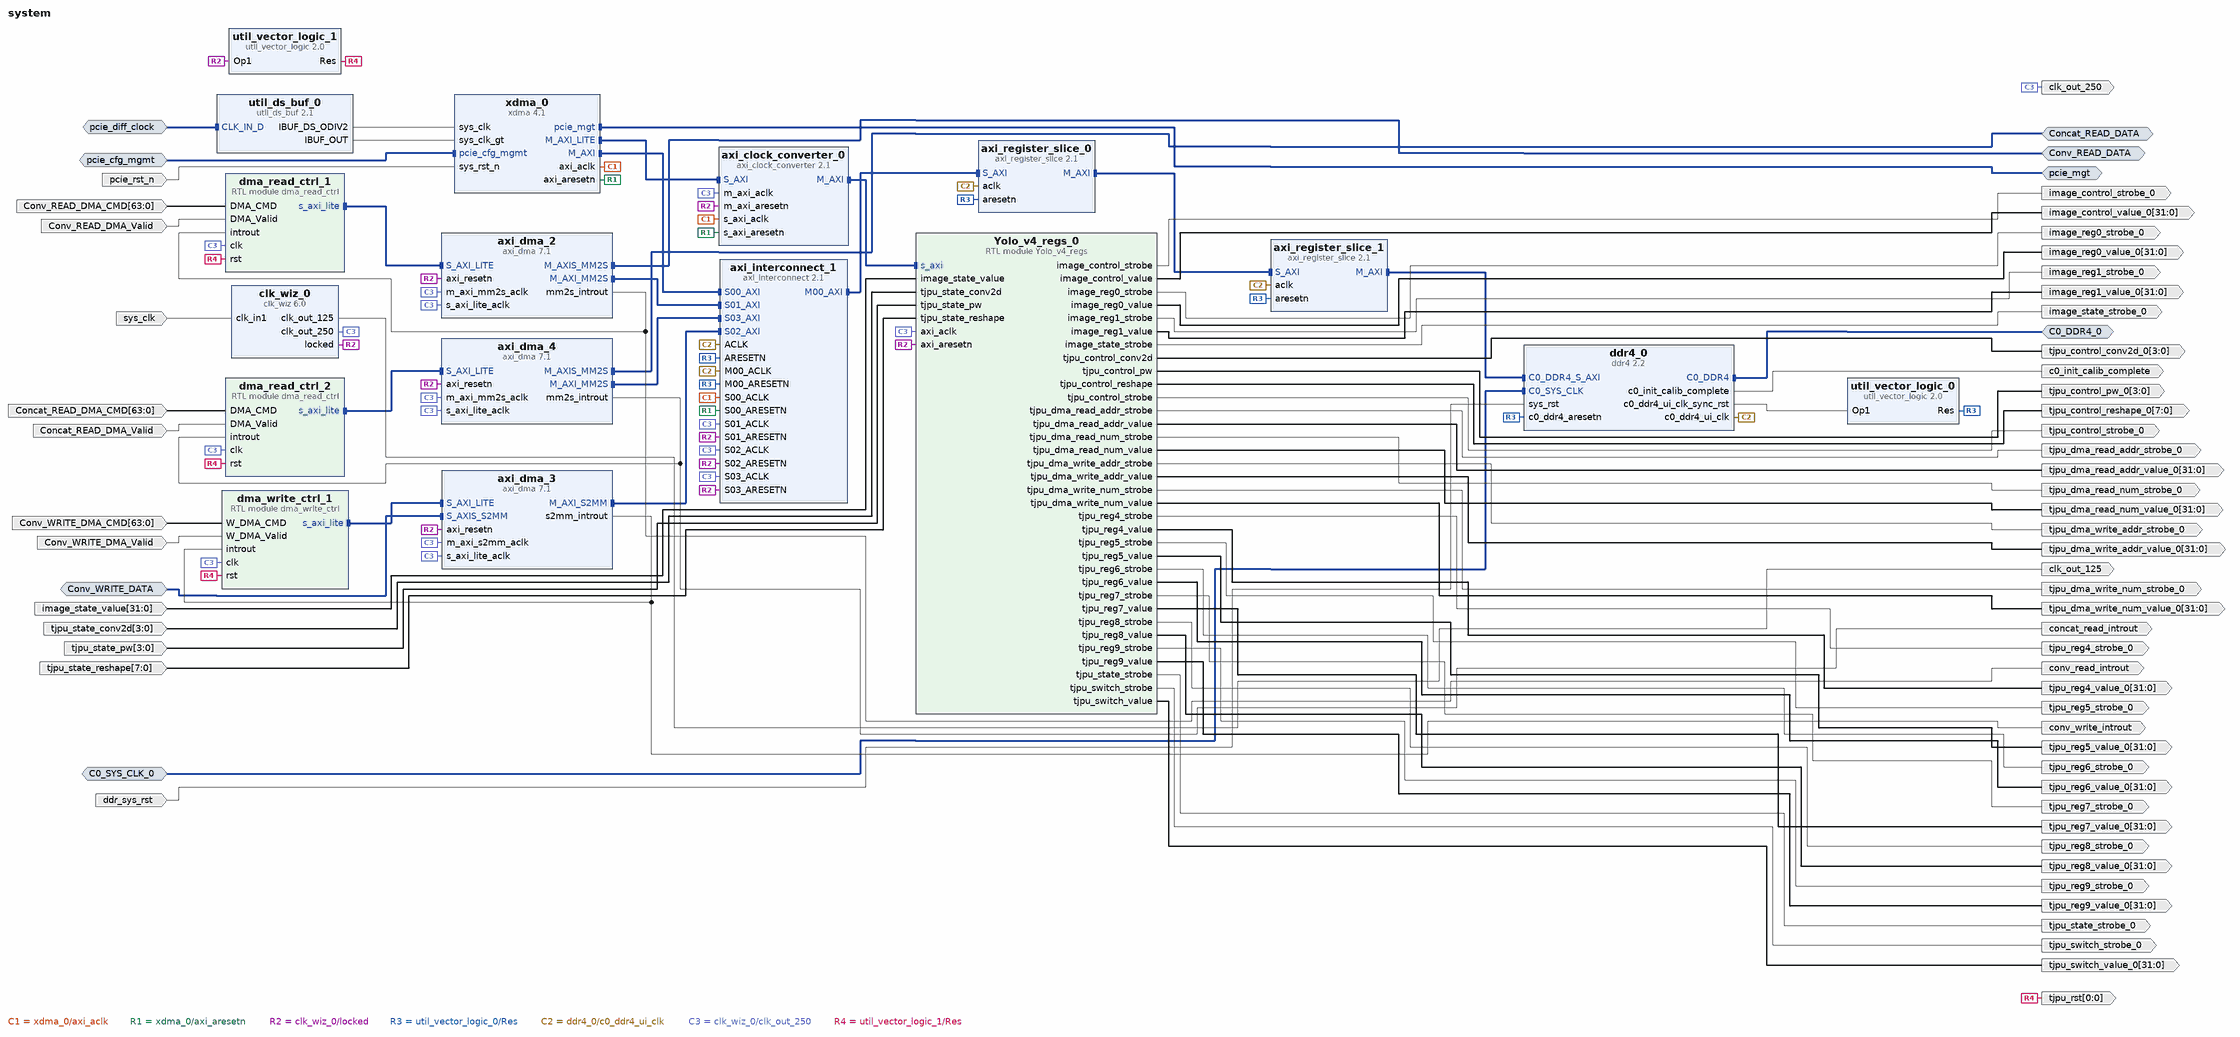
[diagram p0: block diagram of the top level]
# Vivado block design system, xcvu9p-fsgd2104-2LV-e, Vivado 2020.2
create_bd_design system

create_bd_intf_port -mode Slave -vlnv xilinx.com:interface:diff_clock_rtl:1.0 pcie_diff_clock
create_bd_intf_port -mode Slave -vlnv xilinx.com:interface:diff_clock_rtl:1.0 C0_SYS_CLK_0
set_property -dict {CONFIG.FREQ_HZ 200080000} [get_bd_intf_ports C0_SYS_CLK_0]
create_bd_intf_port -mode Slave -vlnv xilinx.com:interface:pcie_cfg_mgmt_rtl:1.0 pcie_cfg_mgmt
create_bd_intf_port -mode Master -vlnv xilinx.com:interface:ddr4_rtl:1.0 C0_DDR4_0
create_bd_intf_port -mode Master -vlnv xilinx.com:interface:pcie_7x_mgt_rtl:1.0 pcie_mgt
create_bd_intf_port -mode Slave -vlnv xilinx.com:interface:axis_rtl:1.0 Conv_WRITE_DATA
set_property -dict [list \
  CONFIG.FREQ_HZ 250000000 \
  CONFIG.HAS_TKEEP 1 \
  CONFIG.HAS_TLAST 1 \
  CONFIG.HAS_TREADY 1 \
  CONFIG.HAS_TSTRB 0 \
  CONFIG.LAYERED_METADATA undef \
  CONFIG.PHASE 0.0 \
  CONFIG.TDATA_NUM_BYTES 32 \
  CONFIG.TDEST_WIDTH 0 \
  CONFIG.TID_WIDTH 0 \
  CONFIG.TUSER_WIDTH 0 \
] [get_bd_intf_ports Conv_WRITE_DATA]
create_bd_intf_port -mode Master -vlnv xilinx.com:interface:axis_rtl:1.0 Conv_READ_DATA
set_property -dict {CONFIG.FREQ_HZ 250000000 CONFIG.PHASE 0.0} [get_bd_intf_ports Conv_READ_DATA]
create_bd_intf_port -mode Master -vlnv xilinx.com:interface:axis_rtl:1.0 Concat_READ_DATA
set_property -dict {CONFIG.FREQ_HZ 250000000 CONFIG.PHASE 0.0} [get_bd_intf_ports Concat_READ_DATA]
create_bd_port -dir I -type rst pcie_rst_n
create_bd_port -dir I -type clk sys_clk
set_property -dict {CONFIG.FREQ_HZ 125000000} [get_bd_ports sys_clk]
create_bd_port -dir I -from 31 -to 0 image_state_value
create_bd_port -dir I -from 3 -to 0 tjpu_state_conv2d
create_bd_port -dir I -from 3 -to 0 tjpu_state_pw
create_bd_port -dir I -from 7 -to 0 tjpu_state_reshape
create_bd_port -dir I -type rst ddr_sys_rst
set_property -dict {CONFIG.POLARITY ACTIVE_HIGH} [get_bd_ports ddr_sys_rst]
create_bd_port -dir I -from 63 -to 0 Conv_READ_DMA_CMD
create_bd_port -dir I -from 63 -to 0 Conv_WRITE_DMA_CMD
create_bd_port -dir I -from 63 -to 0 Concat_READ_DMA_CMD
create_bd_port -dir I Concat_READ_DMA_Valid
create_bd_port -dir I Conv_WRITE_DMA_Valid
create_bd_port -dir I Conv_READ_DMA_Valid
create_bd_port -dir O image_control_strobe_0
create_bd_port -dir O -from 31 -to 0 image_control_value_0
create_bd_port -dir O image_reg0_strobe_0
create_bd_port -dir O -from 31 -to 0 image_reg0_value_0
create_bd_port -dir O image_reg1_strobe_0
create_bd_port -dir O -from 31 -to 0 image_reg1_value_0
create_bd_port -dir O image_state_strobe_0
create_bd_port -dir O -from 3 -to 0 tjpu_control_conv2d_0
create_bd_port -dir O -from 3 -to 0 tjpu_control_pw_0
create_bd_port -dir O -from 7 -to 0 tjpu_control_reshape_0
create_bd_port -dir O tjpu_control_strobe_0
create_bd_port -dir O tjpu_dma_read_addr_strobe_0
create_bd_port -dir O -from 31 -to 0 tjpu_dma_read_addr_value_0
create_bd_port -dir O tjpu_dma_read_num_strobe_0
create_bd_port -dir O -from 31 -to 0 tjpu_dma_read_num_value_0
create_bd_port -dir O tjpu_dma_write_addr_strobe_0
create_bd_port -dir O -from 31 -to 0 tjpu_dma_write_addr_value_0
create_bd_port -dir O tjpu_dma_write_num_strobe_0
create_bd_port -dir O -from 31 -to 0 tjpu_dma_write_num_value_0
create_bd_port -dir O tjpu_reg4_strobe_0
create_bd_port -dir O -from 31 -to 0 tjpu_reg4_value_0
create_bd_port -dir O tjpu_reg5_strobe_0
create_bd_port -dir O -from 31 -to 0 tjpu_reg5_value_0
create_bd_port -dir O tjpu_reg6_strobe_0
create_bd_port -dir O -from 31 -to 0 tjpu_reg6_value_0
create_bd_port -dir O tjpu_reg7_strobe_0
create_bd_port -dir O -from 31 -to 0 tjpu_reg7_value_0
create_bd_port -dir O tjpu_reg8_strobe_0
create_bd_port -dir O -from 31 -to 0 tjpu_reg8_value_0
create_bd_port -dir O tjpu_reg9_strobe_0
create_bd_port -dir O -from 31 -to 0 tjpu_reg9_value_0
create_bd_port -dir O tjpu_state_strobe_0
create_bd_port -dir O tjpu_switch_strobe_0
create_bd_port -dir O -from 31 -to 0 tjpu_switch_value_0
create_bd_port -dir O c0_init_calib_complete
create_bd_port -dir O -type clk clk_out_125
set_property -dict {CONFIG.FREQ_HZ 125000000} [get_bd_ports clk_out_125]
create_bd_port -dir O -type clk clk_out_250
set_property -dict {CONFIG.FREQ_HZ 250000000} [get_bd_ports clk_out_250]
create_bd_port -dir O -type intr conv_read_introut
create_bd_port -dir O -type intr conv_write_introut
create_bd_port -dir O -type intr concat_read_introut
create_bd_port -dir O -from 0 -to 0 tjpu_rst

create_bd_cell -type ip -vlnv xilinx.com:ip:xdma:4.1 xdma_0
set_property -dict [list \
  CONFIG.PF0_DEVICE_ID_mqdma 9038 \
  CONFIG.PF2_DEVICE_ID_mqdma 9038 \
  CONFIG.PF3_DEVICE_ID_mqdma 9038 \
  CONFIG.axi_data_width 256_bit \
  CONFIG.axilite_master_en true \
  CONFIG.axisten_freq 250 \
  CONFIG.cfg_mgmt_if true \
  CONFIG.en_ext_ch_gt_drp false \
  CONFIG.en_pcie_drp false \
  CONFIG.en_transceiver_status_ports false \
  CONFIG.mode_selection Basic \
  CONFIG.pciebar2axibar_axil_master 0x00000000 \
  CONFIG.pf0_device_id 9038 \
  CONFIG.pipe_sim false \
  CONFIG.pl_link_cap_max_link_speed 8.0_GT/s \
  CONFIG.pl_link_cap_max_link_width X8 \
  CONFIG.plltype QPLL1 \
  CONFIG.xdma_pcie_64bit_en true \
] [get_bd_cells xdma_0]
create_bd_cell -type ip -vlnv xilinx.com:ip:ddr4:2.2 ddr4_0
set_property -dict [list \
  CONFIG.C0.BANK_GROUP_WIDTH 1 \
  CONFIG.C0.DDR4_AxiAddressWidth 32 \
  CONFIG.C0.DDR4_AxiDataWidth 512 \
  CONFIG.C0.DDR4_AxiIDWidth 4 \
  CONFIG.C0.DDR4_CasLatency 17 \
  CONFIG.C0.DDR4_CasWriteLatency 16 \
  CONFIG.C0.DDR4_DataMask DM_NO_DBI \
  CONFIG.C0.DDR4_DataWidth 64 \
  CONFIG.C0.DDR4_InputClockPeriod 4998 \
  CONFIG.C0.DDR4_MemoryPart MT40A512M16HA-075E \
] [get_bd_cells ddr4_0]
create_bd_cell -type ip -vlnv xilinx.com:ip:axi_interconnect:2.1 axi_interconnect_1
set_property -dict {CONFIG.NUM_MI 1 CONFIG.NUM_SI 4} [get_bd_cells axi_interconnect_1]
create_bd_cell -type ip -vlnv xilinx.com:ip:util_ds_buf:2.1 util_ds_buf_0
set_property -dict {CONFIG.C_BUF_TYPE IBUFDSGTE CONFIG.C_SIZE 1} [get_bd_cells util_ds_buf_0]
create_bd_cell -type ip -vlnv xilinx.com:ip:clk_wiz:6.0 clk_wiz_0
set_property -dict [list \
  CONFIG.CLKIN1_JITTER_PS 80.0 \
  CONFIG.CLKOUT1_JITTER 105.587 \
  CONFIG.CLKOUT1_PHASE_ERROR 83.589 \
  CONFIG.CLKOUT1_REQUESTED_OUT_FREQ 125.000 \
  CONFIG.CLKOUT2_JITTER 92.841 \
  CONFIG.CLKOUT2_PHASE_ERROR 83.589 \
  CONFIG.CLKOUT2_REQUESTED_OUT_FREQ 250.000 \
  CONFIG.CLKOUT2_USED true \
  CONFIG.CLK_OUT1_PORT clk_out_125 \
  CONFIG.CLK_OUT2_PORT clk_out_250 \
  CONFIG.MMCM_CLKFBOUT_MULT_F 10.000 \
  CONFIG.MMCM_CLKIN1_PERIOD 8.000 \
  CONFIG.MMCM_CLKIN2_PERIOD 10.000 \
  CONFIG.MMCM_CLKOUT0_DIVIDE_F 10.000 \
  CONFIG.MMCM_CLKOUT1_DIVIDE 5 \
  CONFIG.MMCM_DIVCLK_DIVIDE 1 \
  CONFIG.NUM_OUT_CLKS 2 \
  CONFIG.PRIM_IN_FREQ 125.000 \
  CONFIG.USE_RESET false \
] [get_bd_cells clk_wiz_0]
create_bd_cell -type ip -vlnv xilinx.com:ip:axi_register_slice:2.1 axi_register_slice_0
set_property -dict {CONFIG.ADDR_WIDTH 32 CONFIG.DATA_WIDTH 512} [get_bd_cells axi_register_slice_0]
create_bd_cell -type ip -vlnv xilinx.com:ip:axi_register_slice:2.1 axi_register_slice_1
set_property -dict {CONFIG.ADDR_WIDTH 32 CONFIG.DATA_WIDTH 512} [get_bd_cells axi_register_slice_1]
create_bd_cell -type ip -vlnv xilinx.com:ip:util_vector_logic:2.0 util_vector_logic_0
set_property -dict {CONFIG.C_OPERATION not CONFIG.C_SIZE 1} [get_bd_cells util_vector_logic_0]
create_bd_cell -type ip -vlnv xilinx.com:ip:util_vector_logic:2.0 util_vector_logic_1
set_property -dict {CONFIG.C_OPERATION not CONFIG.C_SIZE 1} [get_bd_cells util_vector_logic_1]
create_bd_cell -type ip -vlnv xilinx.com:ip:axi_clock_converter:2.1 axi_clock_converter_0
set_property -dict {CONFIG.PROTOCOL AXI4LITE} [get_bd_cells axi_clock_converter_0]
create_bd_cell -type ip -vlnv xilinx.com:ip:axi_dma:7.1 axi_dma_2
set_property -dict [list \
  CONFIG.c_addr_width 64 \
  CONFIG.c_include_s2mm 0 \
  CONFIG.c_include_sg 0 \
  CONFIG.c_m_axi_mm2s_data_width 512 \
  CONFIG.c_m_axis_mm2s_tdata_width 256 \
  CONFIG.c_mm2s_burst_size 16 \
  CONFIG.c_sg_length_width 26 \
] [get_bd_cells axi_dma_2]
create_bd_cell -type ip -vlnv xilinx.com:ip:axi_dma:7.1 axi_dma_3
set_property -dict [list \
  CONFIG.c_addr_width 64 \
  CONFIG.c_include_mm2s 0 \
  CONFIG.c_include_sg 0 \
  CONFIG.c_m_axi_s2mm_data_width 512 \
  CONFIG.c_s2mm_burst_size 16 \
  CONFIG.c_s_axis_s2mm_tdata_width 256 \
  CONFIG.c_sg_length_width 26 \
] [get_bd_cells axi_dma_3]
create_bd_cell -type ip -vlnv xilinx.com:ip:axi_dma:7.1 axi_dma_4
set_property -dict [list \
  CONFIG.c_addr_width 64 \
  CONFIG.c_include_s2mm 0 \
  CONFIG.c_include_sg 0 \
  CONFIG.c_m_axi_mm2s_data_width 512 \
  CONFIG.c_m_axis_mm2s_tdata_width 256 \
  CONFIG.c_mm2s_burst_size 16 \
  CONFIG.c_sg_length_width 26 \
] [get_bd_cells axi_dma_4]
create_bd_cell -type module -reference Yolo_v4_regs Yolo_v4_regs_0
create_bd_cell -type module -reference dma_read_ctrl dma_read_ctrl_1
create_bd_cell -type module -reference dma_read_ctrl dma_read_ctrl_2
create_bd_cell -type module -reference dma_write_ctrl dma_write_ctrl_1

# ---- connections ----

connect_bd_intf_net [get_bd_intf_pins axi_clock_converter_0/M_AXI] [get_bd_intf_pins Yolo_v4_regs_0/s_axi]
connect_bd_intf_net [get_bd_intf_pins xdma_0/M_AXI] [get_bd_intf_pins axi_interconnect_1/S00_AXI]
connect_bd_intf_net [get_bd_intf_pins dma_read_ctrl_1/s_axi_lite] [get_bd_intf_pins axi_dma_2/S_AXI_LITE]
connect_bd_intf_net [get_bd_intf_pins axi_clock_converter_0/S_AXI] [get_bd_intf_pins xdma_0/M_AXI_LITE]
connect_bd_intf_net [get_bd_intf_pins axi_register_slice_1/M_AXI] [get_bd_intf_pins ddr4_0/C0_DDR4_S_AXI]
connect_bd_intf_net [get_bd_intf_pins dma_write_ctrl_1/s_axi_lite] [get_bd_intf_pins axi_dma_3/S_AXI_LITE]
connect_bd_intf_net -intf_net pcie_cfg_mgmt_0_1 [get_bd_intf_ports pcie_cfg_mgmt] [get_bd_intf_pins xdma_0/pcie_cfg_mgmt]
connect_bd_intf_net [get_bd_intf_ports C0_DDR4_0] [get_bd_intf_pins ddr4_0/C0_DDR4]
connect_bd_intf_net [get_bd_intf_ports Concat_READ_DATA] [get_bd_intf_pins axi_dma_4/M_AXIS_MM2S]
connect_bd_intf_net [get_bd_intf_pins dma_read_ctrl_2/s_axi_lite] [get_bd_intf_pins axi_dma_4/S_AXI_LITE]
connect_bd_intf_net -intf_net C0_SYS_CLK_0_1 [get_bd_intf_ports C0_SYS_CLK_0] [get_bd_intf_pins ddr4_0/C0_SYS_CLK]
connect_bd_intf_net [get_bd_intf_ports Conv_READ_DATA] [get_bd_intf_pins axi_dma_2/M_AXIS_MM2S]
connect_bd_intf_net -intf_net CLK_IN_D_0_1 [get_bd_intf_ports pcie_diff_clock] [get_bd_intf_pins util_ds_buf_0/CLK_IN_D]
connect_bd_intf_net [get_bd_intf_pins axi_dma_3/M_AXI_S2MM] [get_bd_intf_pins axi_interconnect_1/S02_AXI]
connect_bd_intf_net [get_bd_intf_pins axi_register_slice_1/S_AXI] [get_bd_intf_pins axi_register_slice_0/M_AXI]
connect_bd_intf_net [get_bd_intf_pins axi_dma_4/M_AXI_MM2S] [get_bd_intf_pins axi_interconnect_1/S03_AXI]
connect_bd_intf_net -intf_net S_AXIS_S2MM_0_1 [get_bd_intf_ports Conv_WRITE_DATA] [get_bd_intf_pins axi_dma_3/S_AXIS_S2MM]
connect_bd_intf_net [get_bd_intf_pins axi_interconnect_1/S01_AXI] [get_bd_intf_pins axi_dma_2/M_AXI_MM2S]
connect_bd_intf_net [get_bd_intf_ports pcie_mgt] [get_bd_intf_pins xdma_0/pcie_mgt]
connect_bd_intf_net [get_bd_intf_pins axi_interconnect_1/M00_AXI] [get_bd_intf_pins axi_register_slice_0/S_AXI]
connect_bd_net [get_bd_pins util_ds_buf_0/IBUF_DS_ODIV2] [get_bd_pins xdma_0/sys_clk]
connect_bd_net [get_bd_pins util_ds_buf_0/IBUF_OUT] [get_bd_pins xdma_0/sys_clk_gt]
connect_bd_net -net sys_rst_n_0_1 [get_bd_ports pcie_rst_n] [get_bd_pins xdma_0/sys_rst_n]
connect_bd_net -net clk_in1_0_1 [get_bd_ports sys_clk] [get_bd_pins clk_wiz_0/clk_in1]
connect_bd_net [get_bd_pins xdma_0/axi_aclk] [get_bd_pins axi_interconnect_1/S00_ACLK] [get_bd_pins axi_clock_converter_0/s_axi_aclk]
connect_bd_net [get_bd_pins xdma_0/axi_aresetn] [get_bd_pins axi_interconnect_1/S00_ARESETN] [get_bd_pins axi_clock_converter_0/s_axi_aresetn]
connect_bd_net [get_bd_pins clk_wiz_0/locked] \
  [get_bd_pins axi_interconnect_1/S01_ARESETN] [get_bd_pins axi_interconnect_1/S02_ARESETN] \
  [get_bd_pins util_vector_logic_1/Op1] [get_bd_pins axi_clock_converter_0/m_axi_aresetn] [get_bd_pins axi_dma_2/axi_resetn] \
  [get_bd_pins axi_dma_3/axi_resetn] [get_bd_pins axi_dma_4/axi_resetn] [get_bd_pins axi_interconnect_1/S03_ARESETN] \
  [get_bd_pins Yolo_v4_regs_0/axi_aresetn]
connect_bd_net [get_bd_pins ddr4_0/c0_ddr4_ui_clk_sync_rst] [get_bd_pins util_vector_logic_0/Op1]
connect_bd_net [get_bd_pins util_vector_logic_0/Res] \
  [get_bd_pins axi_interconnect_1/M00_ARESETN] [get_bd_pins axi_interconnect_1/ARESETN] \
  [get_bd_pins axi_register_slice_0/aresetn] [get_bd_pins axi_register_slice_1/aresetn] [get_bd_pins ddr4_0/c0_ddr4_aresetn]
connect_bd_net [get_bd_pins ddr4_0/c0_ddr4_ui_clk] \
  [get_bd_pins axi_register_slice_1/aclk] [get_bd_pins axi_register_slice_0/aclk] [get_bd_pins axi_interconnect_1/ACLK] \
  [get_bd_pins axi_interconnect_1/M00_ACLK]
connect_bd_net -net image_state_value_0_1 [get_bd_ports image_state_value] [get_bd_pins Yolo_v4_regs_0/image_state_value]
connect_bd_net -net tjpu_state_conv2d_0_1 [get_bd_ports tjpu_state_conv2d] [get_bd_pins Yolo_v4_regs_0/tjpu_state_conv2d]
connect_bd_net -net tjpu_state_pw_0_1 [get_bd_ports tjpu_state_pw] [get_bd_pins Yolo_v4_regs_0/tjpu_state_pw]
connect_bd_net -net tjpu_state_reshape_0_1 [get_bd_ports tjpu_state_reshape] [get_bd_pins Yolo_v4_regs_0/tjpu_state_reshape]
connect_bd_net -net sys_rst_0_1 [get_bd_ports ddr_sys_rst] [get_bd_pins ddr4_0/sys_rst]
connect_bd_net -net DMA_CMD_0_2 [get_bd_ports Conv_READ_DMA_CMD] [get_bd_pins dma_read_ctrl_1/DMA_CMD]
connect_bd_net -net W_DMA_CMD_0_2 [get_bd_ports Conv_WRITE_DMA_CMD] [get_bd_pins dma_write_ctrl_1/W_DMA_CMD]
connect_bd_net -net DMA_CMD_1_1 [get_bd_ports Concat_READ_DMA_CMD] [get_bd_pins dma_read_ctrl_2/DMA_CMD]
connect_bd_net -net DMA_Valid_0_2 [get_bd_ports Concat_READ_DMA_Valid] [get_bd_pins dma_read_ctrl_2/DMA_Valid]
connect_bd_net -net W_DMA_Valid_0_2 [get_bd_ports Conv_WRITE_DMA_Valid] [get_bd_pins dma_write_ctrl_1/W_DMA_Valid]
connect_bd_net -net DMA_Valid_1_1 [get_bd_ports Conv_READ_DMA_Valid] [get_bd_pins dma_read_ctrl_1/DMA_Valid]
connect_bd_net [get_bd_pins Yolo_v4_regs_0/image_control_strobe] [get_bd_ports image_control_strobe_0]
connect_bd_net [get_bd_pins Yolo_v4_regs_0/image_control_value] [get_bd_ports image_control_value_0]
connect_bd_net [get_bd_pins Yolo_v4_regs_0/image_reg0_strobe] [get_bd_ports image_reg0_strobe_0]
connect_bd_net [get_bd_pins Yolo_v4_regs_0/image_reg0_value] [get_bd_ports image_reg0_value_0]
connect_bd_net [get_bd_pins Yolo_v4_regs_0/image_reg1_strobe] [get_bd_ports image_reg1_strobe_0]
connect_bd_net [get_bd_pins Yolo_v4_regs_0/image_reg1_value] [get_bd_ports image_reg1_value_0]
connect_bd_net [get_bd_pins Yolo_v4_regs_0/image_state_strobe] [get_bd_ports image_state_strobe_0]
connect_bd_net [get_bd_pins Yolo_v4_regs_0/tjpu_control_conv2d] [get_bd_ports tjpu_control_conv2d_0]
connect_bd_net [get_bd_pins Yolo_v4_regs_0/tjpu_control_pw] [get_bd_ports tjpu_control_pw_0]
connect_bd_net [get_bd_pins Yolo_v4_regs_0/tjpu_control_reshape] [get_bd_ports tjpu_control_reshape_0]
connect_bd_net [get_bd_pins Yolo_v4_regs_0/tjpu_control_strobe] [get_bd_ports tjpu_control_strobe_0]
connect_bd_net [get_bd_pins Yolo_v4_regs_0/tjpu_dma_read_addr_strobe] [get_bd_ports tjpu_dma_read_addr_strobe_0]
connect_bd_net [get_bd_pins Yolo_v4_regs_0/tjpu_dma_read_addr_value] [get_bd_ports tjpu_dma_read_addr_value_0]
connect_bd_net [get_bd_pins Yolo_v4_regs_0/tjpu_dma_read_num_strobe] [get_bd_ports tjpu_dma_read_num_strobe_0]
connect_bd_net [get_bd_pins Yolo_v4_regs_0/tjpu_dma_read_num_value] [get_bd_ports tjpu_dma_read_num_value_0]
connect_bd_net [get_bd_pins Yolo_v4_regs_0/tjpu_dma_write_addr_strobe] [get_bd_ports tjpu_dma_write_addr_strobe_0]
connect_bd_net [get_bd_pins Yolo_v4_regs_0/tjpu_dma_write_addr_value] [get_bd_ports tjpu_dma_write_addr_value_0]
connect_bd_net [get_bd_pins Yolo_v4_regs_0/tjpu_dma_write_num_strobe] [get_bd_ports tjpu_dma_write_num_strobe_0]
connect_bd_net [get_bd_pins Yolo_v4_regs_0/tjpu_dma_write_num_value] [get_bd_ports tjpu_dma_write_num_value_0]
connect_bd_net [get_bd_pins Yolo_v4_regs_0/tjpu_reg4_strobe] [get_bd_ports tjpu_reg4_strobe_0]
connect_bd_net [get_bd_pins Yolo_v4_regs_0/tjpu_reg4_value] [get_bd_ports tjpu_reg4_value_0]
connect_bd_net [get_bd_pins Yolo_v4_regs_0/tjpu_reg5_strobe] [get_bd_ports tjpu_reg5_strobe_0]
connect_bd_net [get_bd_pins Yolo_v4_regs_0/tjpu_reg5_value] [get_bd_ports tjpu_reg5_value_0]
connect_bd_net [get_bd_pins Yolo_v4_regs_0/tjpu_reg6_strobe] [get_bd_ports tjpu_reg6_strobe_0]
connect_bd_net [get_bd_pins Yolo_v4_regs_0/tjpu_reg6_value] [get_bd_ports tjpu_reg6_value_0]
connect_bd_net [get_bd_pins Yolo_v4_regs_0/tjpu_reg7_strobe] [get_bd_ports tjpu_reg7_strobe_0]
connect_bd_net [get_bd_pins Yolo_v4_regs_0/tjpu_reg7_value] [get_bd_ports tjpu_reg7_value_0]
connect_bd_net [get_bd_pins Yolo_v4_regs_0/tjpu_reg8_strobe] [get_bd_ports tjpu_reg8_strobe_0]
connect_bd_net [get_bd_pins Yolo_v4_regs_0/tjpu_reg8_value] [get_bd_ports tjpu_reg8_value_0]
connect_bd_net [get_bd_pins Yolo_v4_regs_0/tjpu_reg9_strobe] [get_bd_ports tjpu_reg9_strobe_0]
connect_bd_net [get_bd_pins Yolo_v4_regs_0/tjpu_reg9_value] [get_bd_ports tjpu_reg9_value_0]
connect_bd_net [get_bd_pins Yolo_v4_regs_0/tjpu_state_strobe] [get_bd_ports tjpu_state_strobe_0]
connect_bd_net [get_bd_pins Yolo_v4_regs_0/tjpu_switch_strobe] [get_bd_ports tjpu_switch_strobe_0]
connect_bd_net [get_bd_pins Yolo_v4_regs_0/tjpu_switch_value] [get_bd_ports tjpu_switch_value_0]
connect_bd_net [get_bd_pins ddr4_0/c0_init_calib_complete] [get_bd_ports c0_init_calib_complete]
connect_bd_net [get_bd_pins clk_wiz_0/clk_out_125] [get_bd_ports clk_out_125]
connect_bd_net [get_bd_pins clk_wiz_0/clk_out_250] \
  [get_bd_ports clk_out_250] [get_bd_pins axi_interconnect_1/S01_ACLK] [get_bd_pins axi_interconnect_1/S02_ACLK] \
  [get_bd_pins axi_clock_converter_0/m_axi_aclk] [get_bd_pins axi_dma_2/s_axi_lite_aclk] \
  [get_bd_pins axi_dma_2/m_axi_mm2s_aclk] [get_bd_pins axi_dma_3/s_axi_lite_aclk] [get_bd_pins axi_dma_3/m_axi_s2mm_aclk] \
  [get_bd_pins axi_dma_4/s_axi_lite_aclk] [get_bd_pins axi_dma_4/m_axi_mm2s_aclk] [get_bd_pins axi_interconnect_1/S03_ACLK] \
  [get_bd_pins Yolo_v4_regs_0/axi_aclk] [get_bd_pins dma_read_ctrl_1/clk] [get_bd_pins dma_read_ctrl_2/clk] \
  [get_bd_pins dma_write_ctrl_1/clk]
connect_bd_net [get_bd_pins axi_dma_2/mm2s_introut] [get_bd_ports conv_read_introut] [get_bd_pins dma_read_ctrl_1/introut]
connect_bd_net [get_bd_pins axi_dma_3/s2mm_introut] [get_bd_ports conv_write_introut] [get_bd_pins dma_write_ctrl_1/introut]
connect_bd_net [get_bd_pins axi_dma_4/mm2s_introut] [get_bd_ports concat_read_introut] [get_bd_pins dma_read_ctrl_2/introut]
connect_bd_net [get_bd_pins util_vector_logic_1/Res] \
  [get_bd_ports tjpu_rst] [get_bd_pins dma_read_ctrl_1/rst] [get_bd_pins dma_read_ctrl_2/rst] \
  [get_bd_pins dma_write_ctrl_1/rst]

# ---- address map ----
assign_bd_address -offset 0x0000000000000000 -range 4G -target_address_space [get_bd_addr_spaces axi_dma_2/Data_MM2S] [get_bd_addr_segs ddr4_0/C0_DDR4_MEMORY_MAP/C0_DDR4_ADDRESS_BLOCK]
assign_bd_address -offset 0x0000000000000000 -range 4G -target_address_space [get_bd_addr_spaces axi_dma_3/Data_S2MM] [get_bd_addr_segs ddr4_0/C0_DDR4_MEMORY_MAP/C0_DDR4_ADDRESS_BLOCK]
assign_bd_address -offset 0x0000000000000000 -range 4G -target_address_space [get_bd_addr_spaces axi_dma_4/Data_MM2S] [get_bd_addr_segs ddr4_0/C0_DDR4_MEMORY_MAP/C0_DDR4_ADDRESS_BLOCK]
assign_bd_address -offset 0x0000 -range 4K -target_address_space [get_bd_addr_spaces dma_read_ctrl_1/s_axi_lite] [get_bd_addr_segs axi_dma_2/S_AXI_LITE/Reg]
assign_bd_address -offset 0x0000 -range 4K -target_address_space [get_bd_addr_spaces dma_read_ctrl_2/s_axi_lite] [get_bd_addr_segs axi_dma_4/S_AXI_LITE/Reg]
assign_bd_address -offset 0x0000 -range 4K -target_address_space [get_bd_addr_spaces dma_write_ctrl_1/s_axi_lite] [get_bd_addr_segs axi_dma_3/S_AXI_LITE/Reg]
assign_bd_address -offset 0x0000000000000000 -range 4G -target_address_space [get_bd_addr_spaces xdma_0/M_AXI] [get_bd_addr_segs ddr4_0/C0_DDR4_MEMORY_MAP/C0_DDR4_ADDRESS_BLOCK]
assign_bd_address -offset 0x00000000 -range 4G -target_address_space [get_bd_addr_spaces xdma_0/M_AXI_LITE] [get_bd_addr_segs Yolo_v4_regs_0/s_axi/reg0]

validate_bd_design
save_bd_design
